# EAGLE schematic Squirco Power v1.0 (EAGLE 6.5.0)
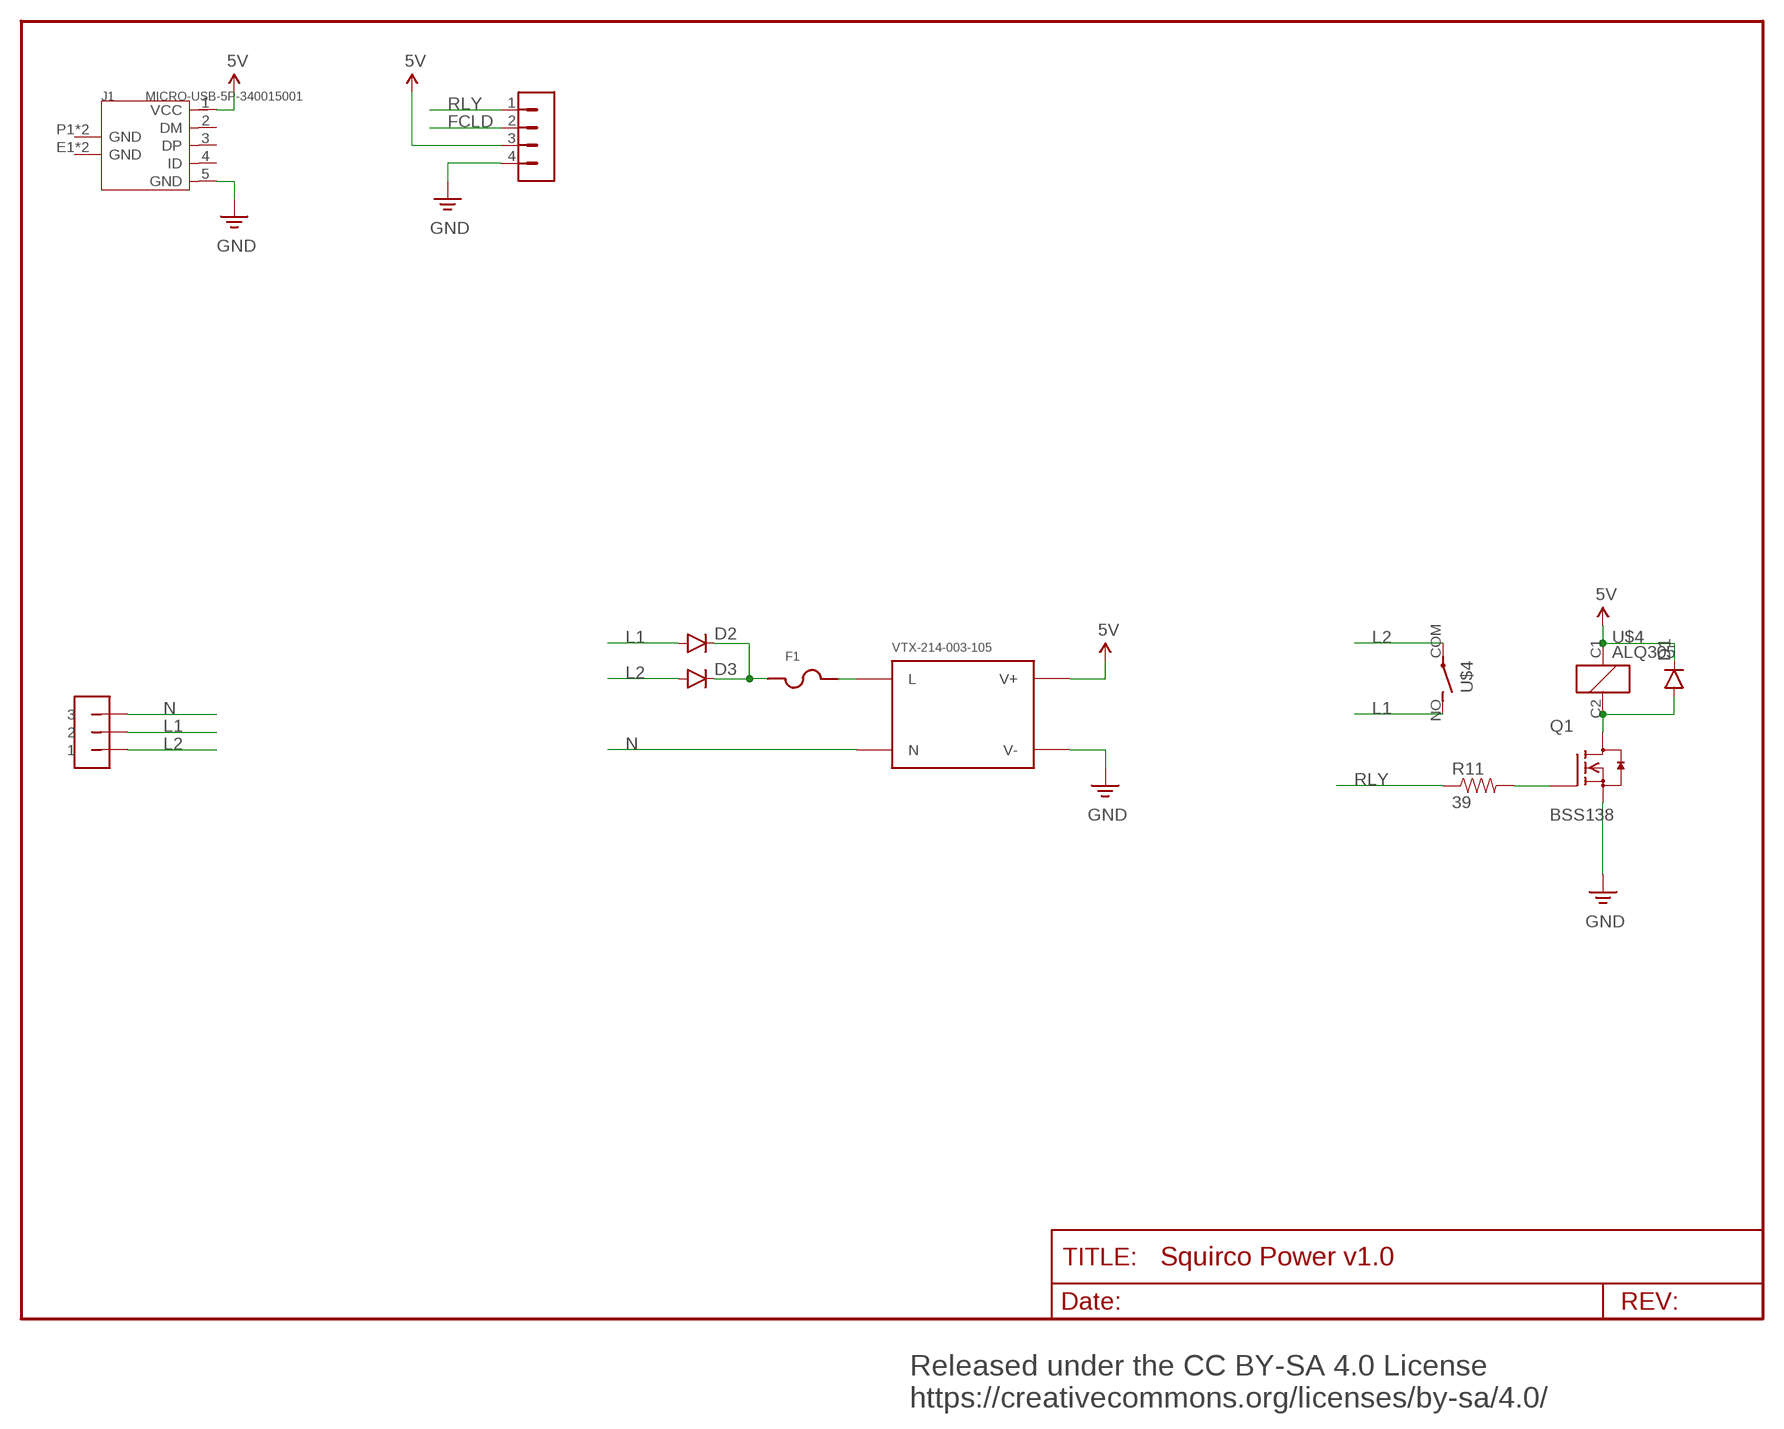
[diagram p0: schematic, sheet 1]

## Parts
D1  DIODESMB  [SMB-DIODE]
D2  DIODESMB  [SMB-DIODE]
D3  DIODESMB  [SMB-DIODE]
F1  UMT250  [UMT250]
J1  MICRO-USB-5P-340015001  [B-SMD-5P]
JP2  LSF-SMT5  [LF-SMT5]
Q1  BSS138  [SOT23]
R11  39  RESISTOR0603  [0603-RES]
U$1  VTX-214-003-105  [VTX-214-003-1XX]
U$3  S04-4MM  [S04-4MM]
U$4  ALQ305  [ALQ305]

## Nets
5V: D1.C J1.1(VCC) U$1.3(V+) U$3.3 U$4.C1
FCLD: U$3.2
GND: J1.5(GND) Q1.2(S) U$1.4(V-) U$3.4
L1 [120v Mains 5A]: D2.A JP2.3 JP2.4 U$4.NO(S)
L2 [120v Mains 5A]: D3.A JP2.1 JP2.2 U$4.COM(P)
N [120v Mains 5A]: JP2.5 JP2.6 U$1.1(N)
N$1: F1.P$2 U$1.2(L)
N$4: Q1.1(G) R11.2
N$14 [120v Mains 5A]: D2.C D3.C F1.P$1
N$15: D1.A Q1.3(D) U$4.C2
RLY: R11.1 U$3.1
Unconnected: J1.2(DM) J1.3(DP) J1.4(ID) J1.E1(GND) J1.E2(GND) J1.P1(GND) J1.P2(GND)

## Notes on the sheet
- Released under the CC BY-SA 4.0 License
  https://creativecommons.org/licenses/by-sa/4.0/

## Library data of the parts
D1-D3 = SparkFun-DiscreteSemi:DIODE: Diode These are standard reverse protection diodes and small signal diodes. SMA package can handle up to about 1A. SOD-323 can handle about 200mA. What the SOD-323 package when ordering, there are some mfgs out there that are 5-pin packages.; PROD_ID: DIO-09646
F1 = L1:UMT250
J1 = Connector:MICRO-USB-5P: When you use the footprint ,place notice 46 (layer)milling ,there is some important information.
JP2 = L1:LSF-SMT5
Q1 = m-pad-2.1:BSS138: Fairchild Semiconductors BSS138 N-Channel Logic Level Enhancement Mode Field Effect Transistor General Description: These N-Channel enhancement mode field effect transistors are produced using Fairchild's proprietary, high cell density, DMOS technology. These products have been designed to minimize on-state resistance while provide rugged, reliable, and fast switching performance.These products are particularly suited for low voltage, low current applications such as small servo motor control, power MOSFET gate drivers, and other switching applications. Features: 0.22 A, 50 V. RDS(ON) = 3.5Ohm @ VGS = 10 V RDS(ON) = 6.0Ohm @ VGS = 4.5 V High density cell design for extremely low RDS(ON) Rugged and Reliable Compact industry standard SOT-23 surface mount package Please send any comments to: messi@users.sourceforge.net
R11 = SparkFun-Resistors:RESISTOR: Resistor Basic schematic elements and footprints for 0603, 1206, and PTH resistors.
U$1 = SMPS:VTX-214-003-105
U$3 = pinhead-half:S04-4MM
U$4 = relay:ALQ305

## Net classes
1 Tline: width 0.003 mm, drill 0.33 mm
2 120v Mains 5A: clearance 1.27 mm